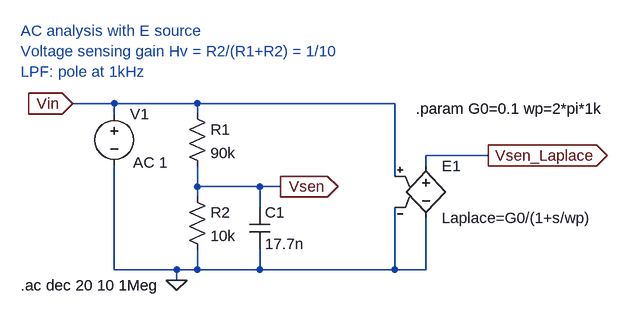
[diagram p0: schematic LTspice 04-4 Laplace by E ac analysis.asc]
LTspice 04-4 Laplace by E ac analysis.asc, the LTspice schematic file:
Version 4
SHEET 1 1196 680
WIRE 400 192 336 192
WIRE 528 192 400 192
WIRE 832 192 528 192
WIRE 400 208 400 192
WIRE 528 208 528 192
WIRE 976 272 880 272
WIRE 880 288 880 272
WIRE 832 304 832 192
WIRE 528 320 528 288
WIRE 624 320 528 320
WIRE 656 320 624 320
WIRE 528 336 528 320
WIRE 624 352 624 320
WIRE 400 448 400 288
WIRE 496 448 400 448
WIRE 528 448 528 416
WIRE 528 448 496 448
WIRE 624 448 624 416
WIRE 624 448 528 448
WIRE 832 448 832 352
WIRE 832 448 624 448
WIRE 880 448 880 368
WIRE 880 448 832 448
WIRE 496 464 496 448
FLAG 496 464 0
FLAG 656 320 Vsen
IOPIN 656 320 Out
FLAG 336 192 Vin
IOPIN 336 192 In
FLAG 976 272 Vsen_Laplace
IOPIN 976 272 Out
SYMBOL voltage 400 192 R0
WINDOW 123 29 91 Left 2
WINDOW 39 0 0 Left 2
WINDOW 3 -197 60 Left 2
SYMATTR Value2 AC 1
SYMATTR Value ""
SYMATTR InstName V1
SYMBOL res 512 192 R0
SYMATTR InstName R1
SYMATTR Value 90k
SYMBOL res 512 320 R0
SYMATTR InstName R2
SYMATTR Value 10k
SYMBOL cap 608 352 R0
SYMATTR InstName C1
SYMATTR Value 17.7n
SYMBOL e 880 272 R0
SYMATTR InstName E1
SYMATTR Value Laplace=G0/(1+s/wp)
TEXT 256 472 Left 2 !.ac dec 20 10 1Meg
TEXT 256 80 Left 2 ;AC analysis with E source\nVoltage sensing gain Hv = R2/(R1+R2) = 1/10\nLPF: pole at 1kHz
TEXT 864 200 Left 2 !.param G0=0.1 wp=2*pi*1k

The netlist it stands for:
* LTspice 04-4 Laplace by E ac analysis.asc
V1 Vin 0 AC 1
R1 Vin Vsen 90k
R2 Vsen 0 10k
C1 Vsen 0 17.7n
E1 Vsen_Laplace 0 Vin 0 Laplace=G0/(1+s/wp)
.ac dec 20 10 1Meg
* AC analysis with E source
* Voltage sensing gain Hv = R2/(R1+R2) = 1/10
* LPF: pole at 1kHz
.param G0=0.1 wp=2*pi*1k
.backanno
.end